# Altium schematic sheet MMC-MAG.SchDoc
size A3; SheetNumber: 1; SheetTotal: 1
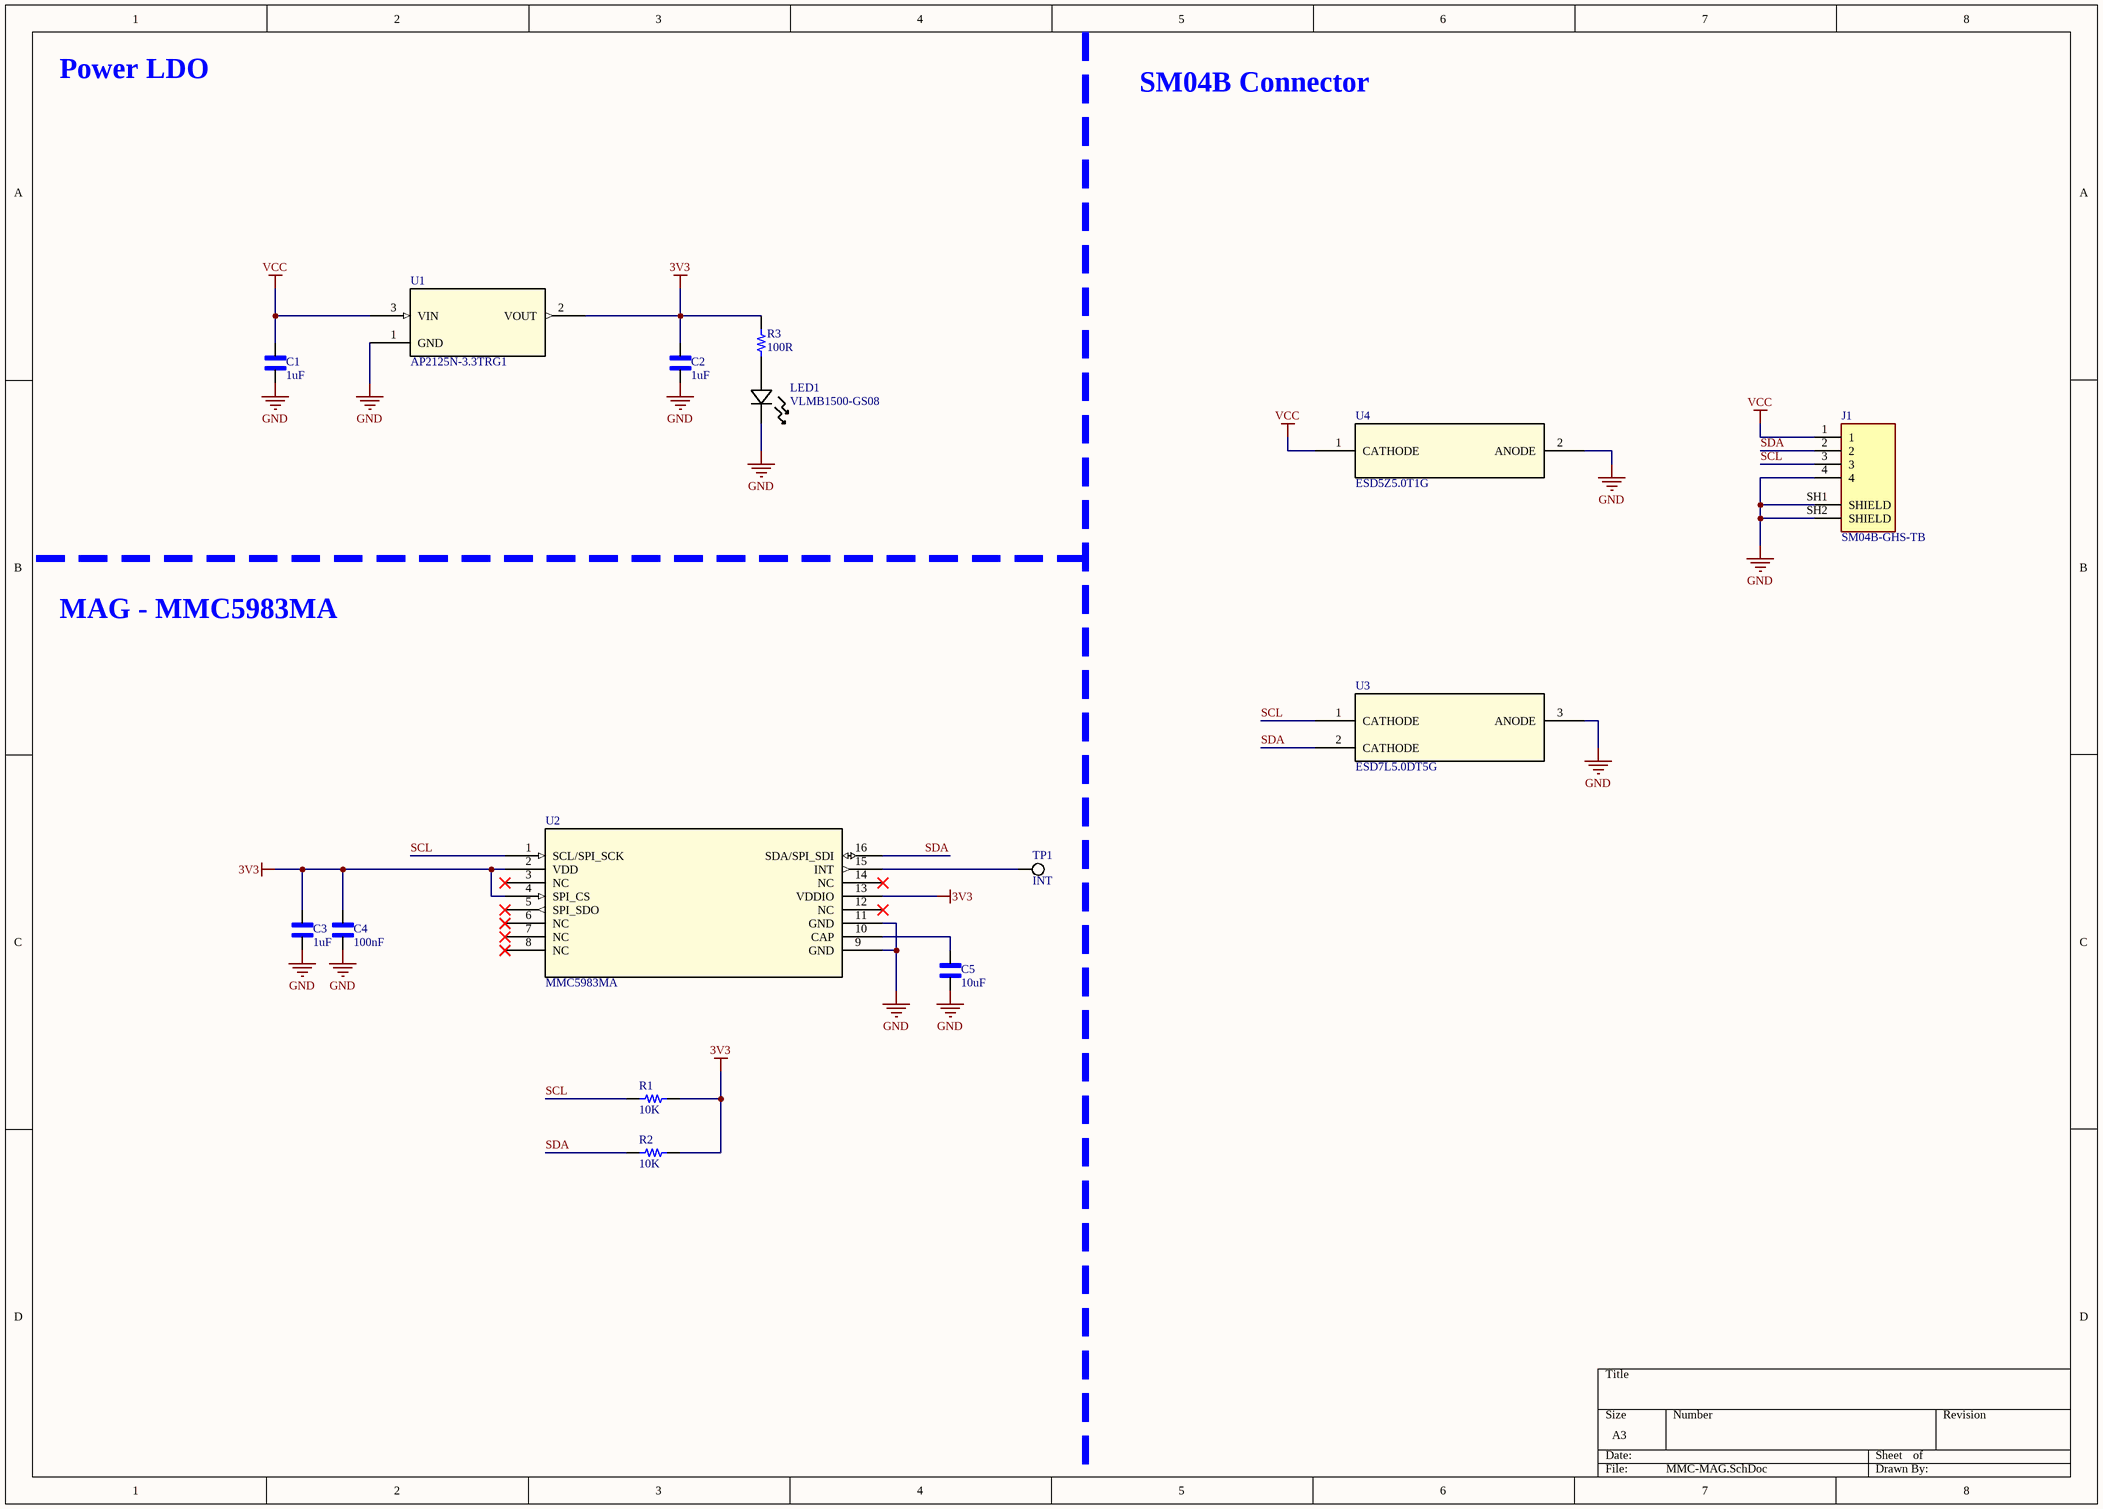
[diagram p0: MMC-MAG.SchDoc]

## Parts
C1  1uF  [CAP0402]
C2  1uF  [CAP0402]
C3  1uF  [CAP0402]
C4  100nF  [CAP0402]
C5  10uF  [CAP0402]
J1  SM04B-GHS-TB  [JST_SM04B-GHS-TB(LF)(SN)-]
LED1  VLMB1500-GS08  [LED_500-GS08_VIS]
R1  10K  [RES 0402_1005]
R2  10K  [RES 0402_1005]
R3  100R  [RES 0402_1005]
TP1  INT  [TEST_POINT]
U1  AP2125N-3.3TRG1  [SOT-23_DIO]
U2  MMC5983MA  [MMC5983MA_MEM]
U3  ESD7L5.0DT5G  [SOT-723_0P85X1P25_ONS]
U4  ESD5Z5.0T1G  [SOD-523_0P9X1P3_ONS]

## Nets
3V3: C2.2 C3.2 C4.2 R1.2 R2.1 R3.2 U1.2(VOUT) U2.2(VDD) U2.4(SPI_CS) U2.13(VDDIO)
GND: C1.1 C2.1 C3.1 C4.1 C5.1 J1.4 J1.SH1(SHIELD) J1.SH2(SHIELD) LED1.1 U1.1(GND) U2.9(GND) U2.11(GND) U3.3(ANODE) U4.2(ANODE)
VCC: C1.2 J1.1 U1.3(VIN) U4.1(CATHODE)
SCL: J1.3 R1.1 U2.1(SCL/SPI_SCK) U3.1(CATHODE)
SDA: J1.2 R2.2 U2.16(SDA/SPI_SDI) U3.2(CATHODE)
NetC5_2: C5.2 U2.10(CAP)
NetLED1_2: LED1.2 R3.1
NetTP1_1: TP1.1 U2.15(INT)

Not connected (* = marked no-connect by the designer): U2 3(NC)* 5(SPI_SDO)* 6(NC)* 7(NC)* 8(NC)* 12(NC)* 14(NC)*

## Notes on the sheet
- Power LDO
- SM04B Connector
- MAG - MMC5983MA

## Library data of the parts
C1-C3 = GRM155R61E105KA12D: 1 ÂµF Â±10% 25V Ceramic Capacitor X5R 0402 (1005 Metric); MF: Murata; SnapEDA_Link: https://www.snapeda.com/parts/GRM155R61E105KA12D/Murata/view-part/?ref=snap; Package: 1005-2 Murata; Value: *; MPN: GRM155R61E105KA12D; Check_prices: https://www.snapeda.com/parts/GRM155R61E105KA12D/Murata/view-part/?ref=eda
C4 = GRM155R61A104KA01D: Ceramic Capacitor, Ceramic, 10V, 10% +Tol, 10% -Tol, X5R, 15% TC, 0.1uF, Surface Mount, 0402; Manufacturer: Murata; Manufacturer Lifecycle Status: NRND; Supplier: DigiKey; Supplier Part Number: 490-1318-1-ND; Manufacturer Part Number: GRM155R61A104KA01D; RoHS: Compliant; Category: Ceramic Capacitors; Stock: 2544850; Pricing: 1=0.1, 10=0.026, 50=0.0174, 100=0.0148, 500=0.0104, 1000=0.00907, 2500=0.00768, 5000=0.00684 (USD); Value: 100nF; Case/Package: 0402; Case Code (Imperial): 0402; Case Code (Metric): 1005; Depth: 500µm; Dielectric: X5R; Dielectric Material: Ceramic; Height: 500µm; Lead Free: Lead Free; Length: 1mm; Lifecycle Status: NRND; Max Operating Temperature: 85°C; Min Operating Temperature: -55°C; Mounting Technology: Surface Mount; Pins: 2; Number of Terminals: 2; Packaging: Cut Tape; Radiation Hardening: No; REACH SVHC: Yes; Schedule B: 8532240020, 8532240020|8532240020, 8532240020|8532240020|8532240020, 8532240020|8532240020|8532240020|8532240020; Termination: SMD/SMT; Thickness: 500µm; Tolerance: 10%; Voltage: 10V; Voltage Rating: 10V; Voltage Rating (DC): 10V; Width: 500µm; ComponentLink1URL: https://datasheet.octopart.com:443/GRM155R61A104KA01D-Murata-datasheet-78375005.pdf?src-supplier=Upverter; ComponentLink1Description: https://datasheet.octopart.com:443/GRM155R61A104KA01D-Murata-datasheet-78375005.pdf?src-supplier=Upverter; ComponentLink2URL: https://datasheet.octopart.com:443/GRM155R61A104KA01D-Murata-datasheet-102.pdf?src-supplier=Upverter; ComponentLink2Description: https://datasheet.octopart.com:443/GRM155R61A104KA01D-Murata-datasheet-102.pdf?src-supplier=Upverter; ComponentLink3URL: https://datasheet.octopart.com:443/GRM155R61A104KA01D-Murata-datasheet-141446445.pdf?src-supplier=Upverter; ComponentLink3Description: https://datasheet.octopart.com:443/GRM155R61A104KA01D-Murata-datasheet-141446445.pdf?src-supplier=Upverter; ComponentLink4URL: https://datasheet.octopart.com:443/GRM155R61A104KA01D-Murata-datasheet-8817987.pdf?src-supplier=element14+APAC; ComponentLink4Description: https://datasheet.octopart.com:443/GRM155R61A104KA01D-Murata-datasheet-8817987.pdf?src-supplier=element14+APAC; ComponentLink5URL: https://datasheet.octopart.com:443/GRM155R61A104KA01D-Murata-datasheet-62317102.pdf?src-supplier=element14+APAC; ComponentLink5Description: https://datasheet.octopart.com:443/GRM155R61A104KA01D-Murata-datasheet-62317102.pdf?src-supplier=element14+APAC; ComponentLink6URL: https://datasheet.octopart.com:443/GRM155R61A104KA01D-Murata-datasheet-8329115.pdf?src-supplier=_legacy+Avnet; ComponentLink6Description: https://datasheet.octopart.com:443/GRM155R61A104KA01D-Murata-datasheet-8329115.pdf?src-supplier=_legacy+Avnet; ComponentLink7URL: https://datasheet.octopart.com:443/GRM155R61A104KA01D-Murata-datasheet-141266224.pdf?src-supplier=Ciiva; ComponentLink7Description: https://datasheet.octopart.com:443/GRM155R61A104KA01D-Murata-datasheet-141266224.pdf?src-supplier=Ciiva; ComponentLink8URL: https://datasheet.octopart.com:443/GRM155R61A104KA01D-Murata-datasheet-140689730.pdf?src-supplier=Ciiva; ComponentLink8Description: https://datasheet.octopart.com:443/GRM155R61A104KA01D-Murata-datasheet-140689730.pdf?src-supplier=Ciiva; ComponentLink9URL: https://datasheet.octopart.com:443/GRM155R61A104KA01D-Murata-datasheet-138740686.pdf?src-supplier=Ciiva; ComponentLink9Description: https://datasheet.octopart.com:443/GRM155R61A104KA01D-Murata-datasheet-138740686.pdf?src-supplier=Ciiva; ComponentLink10URL: https://datasheet.octopart.com:443/GRM155R61A104KA01D-Murata-datasheet-140710158.pdf?src-supplier=TME; ComponentLink10Description: https://datasheet.octopart.com:443/GRM155R61A104KA01D-Murata-datasheet-140710158.pdf?src-supplier=TME; ComponentLink11URL: https://datasheet.octopart.com:443/GRM155R61A104KA01D-Murata-datasheet-120101189.pdf?src-supplier=Megastar; ComponentLink11Description: https://datasheet.octopart.com:443/GRM155R61A104KA01D-Murata-datasheet-120101189.pdf?src-supplier=Megastar; ComponentLink12URL: https://datasheet.octopart.com:443/GRM155R61A104KA01D-Murata-datasheet-22122223.pdf?src-supplier=Future+Electronics; ComponentLink12Description: https://datasheet.octopart.com:443/GRM155R61A104KA01D-Murata-datasheet-22122223.pdf?src-supplier=Future+Electronics; ComponentLink13URL: https://datasheet.octopart.com:443/GRM155R61A104KA01D-Murata-datasheet-14396860.pdf?src-supplier=Future+Electronics; ComponentLink13Description: https://datasheet.octopart.com:443/GRM155R61A104KA01D-Murata-datasheet-14396860.pdf?src-supplier=Future+Electronics; ComponentLink14URL: https://datasheet.octopart.com:443/GRM155R61A104KA01D-Murata-datasheet-44106124.pdf?src-supplier=Future+Electronics; ComponentLink14Description: https://datasheet.octopart.com:443/GRM155R61A104KA01D-Murata-datasheet-44106124.pdf?src-supplier=Future+Electronics; ComponentLink15URL: https://datasheet.octopart.com/GRM155R61A104KA01D-Murata-datasheet-12515295.pdf; ComponentLink15Description: https://datasheet.octopart.com/GRM155R61A104KA01D-Murata-datasheet-12515295.pdf; ComponentLink16URL: https://datasheet.octopart.com/GRM155R61A104KA01D-Murata-datasheet-12510076.pdf; ComponentLink16Description: https://datasheet.octopart.com/GRM155R61A104KA01D-Murata-datasheet-12510076.pdf; ComponentLink17URL: https://datasheet.octopart.com/GRM155R61A104KA01D-Murata-datasheet-11978611.pdf; ComponentLink17Description: https://datasheet.octopart.com/GRM155R61A104KA01D-Murata-datasheet-11978611.pdf; ComponentLink18URL: https://datasheet.octopart.com/GRM155R61A104KA01D-Murata-datasheet-10025737.pdf; ComponentLink18Description: https://datasheet.octopart.com/GRM155R61A104KA01D-Murata-datasheet-10025737.pdf; ComponentLink19URL: https://datasheet.octopart.com/GRM155R61A104KA01D-Murata-datasheet-8819587.pdf; ComponentLink19Description: https://datasheet.octopart.com/GRM155R61A104KA01D-Murata-datasheet-8819587.pdf; ComponentLink20URL: https://datasheet.octopart.com/GRM155R61A104KA01D-Murata-datasheet-14400509.pdf; ComponentLink20Description: https://datasheet.octopart.com/GRM155R61A104KA01D-Murata-datasheet-14400509.pdf; ComponentLink21URL: https://datasheet.octopart.com:443/GRM155R61A104KA01D-Murata-datasheet-12510170.pdf?src-supplier=Factory+Futures; ComponentLink21Description: https://datasheet.octopart.com:443/GRM155R61A104KA01D-Murata-datasheet-12510170.pdf?src-supplier=Factory+Futures; ComponentLink22URL: https://datasheet.octopart.com:443/GRM155R61A104KA01D-Murata-datasheet-8517407.pdf?src-supplier=Factory+Futures; ComponentLink22Description: https://datasheet.octopart.com:443/GRM155R61A104KA01D-Murata-datasheet-8517407.pdf?src-supplier=Factory+Futures; ComponentLink23URL: https://datasheet.octopart.com:443/GRM155R61A104KA01D-Murata-datasheet-8387045.pdf?src-supplier=Factory+Futures; ComponentLink23Description: https://datasheet.octopart.com:443/GRM155R61A104KA01D-Murata-datasheet-8387045.pdf?src-supplier=Factory+Futures; ComponentLink24URL: https://datasheet.octopart.com:443/GRM155R61A104KA01D-Murata-datasheet-8324201.pdf?src-supplier=Factory+Futures; ComponentLink24Description: https://datasheet.octopart.com:443/GRM155R61A104KA01D-Murata-datasheet-8324201.pdf?src-supplier=Factory+Futures; ComponentLink25URL: https://datasheet.octopart.com:443/GRM155R61A104KA01D-Murata-datasheet-7628724.pdf?src-supplier=Factory+Futures; ComponentLink25Description: https://datasheet.octopart.com:443/GRM155R61A104KA01D-Murata-datasheet-7628724.pdf?src-supplier=Factory+Futures; ComponentLink26URL: https://datasheet.octopart.com:443/GRM155R61A104KA01D-Murata-datasheet-552801.pdf?src-supplier=Factory+Futures; ComponentLink26Description: https://datasheet.octopart.com:443/GRM155R61A104KA01D-Murata-datasheet-552801.pdf?src-supplier=Factory+Futures; ComponentLink27URL: https://datasheet.octopart.com:443/GRM155R61A104KA01D-Murata-datasheet-11797706.pdf?src-supplier=Arrow+Electronics; ComponentLink27Description: https://datasheet.octopart.com:443/GRM155R61A104KA01D-Murata-datasheet-11797706.pdf?src-supplier=Arrow+Electronics; ComponentLink28URL: https://datasheet.octopart.com:443/GRM155R61A104KA01D.-Murata-datasheet-5332913.pdf?src-supplier=Farnell; ComponentLink28Description: https://datasheet.octopart.com:443/GRM155R61A104KA01D.-Murata-datasheet-5332913.pdf?src-supplier=Farnell; ComponentLink29URL: http://sigma.octopart.com:80/reach_statement/Murata-company-16.pdf?src-supplier=Compliance+Statements; ComponentLink29Description: http://sigma.octopart.com:80/reach_statement/Murata-company-16.pdf?src-supplier=Compliance+Statements
C5 = GRM155R61A106ME11D: Ceramic Capacitor, Ceramic, 10V, 20% +Tol, 20% -Tol, X5R, 15% TC, 10uF, Surface Mount, 0402; Manufacturer: Murata; Manufacturer Lifecycle Status: IN PRODUCTION; Value: 10µF; Supplier: DigiKey; Supplier Part Number: 490-GRM155R61A106ME11DCT-ND; Manufacturer Part Number: GRM155R61A106ME11D; RoHS: Compliant; Category: Ceramic Capacitors; Stock: 1513396; Pricing: 1=0.08, 10=0.014 (USD); Case/Package: 0402; Dielectric: X5R; Dielectric Material: Ceramic; Height: 500µm; Length: 1mm; Lifecycle Status: Production; Material: Ceramic; Max Operating Temperature: 85°C; Min Operating Temperature: -55°C; Mounting Technology: Surface Mount; Number of Terminals: 2; REACH SVHC: Yes; Thickness: 500µm; Tolerance: 20%; Voltage Rating: 10V; Voltage Rating (DC): 10V; Width: 500µm; ComponentLink1URL: https://datasheet.octopart.com:443/GRM155R61A106ME11D-Murata-datasheet-155239053.pdf?src-supplier=Newark; ComponentLink1Description: https://datasheet.octopart.com:443/GRM155R61A106ME11D-Murata-datasheet-155239053.pdf?src-supplier=Newark; ComponentLink2URL: https://datasheet.octopart.com:443/GRM155R61A106ME11D-Murata-datasheet-178522865.pdf?src-supplier=Arrow.cn; ComponentLink2Description: https://datasheet.octopart.com:443/GRM155R61A106ME11D-Murata-datasheet-178522865.pdf?src-supplier=Arrow.cn; ComponentLink3URL: https://datasheet.octopart.com:443/GRM155R61A106ME11D-Murata-datasheet-165579666.pdf?src-supplier=TME; ComponentLink3Description: https://datasheet.octopart.com:443/GRM155R61A106ME11D-Murata-datasheet-165579666.pdf?src-supplier=TME; ComponentLink4URL: https://datasheet.octopart.com:443/GRM155R61A106ME11D-Murata-datasheet-141266224.pdf?src-supplier=Ciiva; ComponentLink4Description: https://datasheet.octopart.com:443/GRM155R61A106ME11D-Murata-datasheet-141266224.pdf?src-supplier=Ciiva; ComponentLink5URL: https://datasheet.octopart.com:443/GRM155R61A106ME11D-Murata-datasheet-140689744.pdf?src-supplier=Ciiva; ComponentLink5Description: https://datasheet.octopart.com:443/GRM155R61A106ME11D-Murata-datasheet-140689744.pdf?src-supplier=Ciiva; ComponentLink6URL: https://datasheet.octopart.com:443/GRM155R61A106ME11D-Murata-datasheet-138740692.pdf?src-supplier=Ciiva; ComponentLink6Description: https://datasheet.octopart.com:443/GRM155R61A106ME11D-Murata-datasheet-138740692.pdf?src-supplier=Ciiva; ComponentLink7URL: https://datasheet.octopart.com/GRM155R61A106ME11D-Murata-datasheet-12515295.pdf; ComponentLink7Description: https://datasheet.octopart.com/GRM155R61A106ME11D-Murata-datasheet-12515295.pdf; ComponentLink8URL: https://datasheet.octopart.com/GRM155R61A106ME11D-Murata-datasheet-12510076.pdf; ComponentLink8Description: https://datasheet.octopart.com/GRM155R61A106ME11D-Murata-datasheet-12510076.pdf; ComponentLink9URL: https://datasheet.octopart.com/GRM155R61A106ME11D-Murata-datasheet-11978611.pdf; ComponentLink9Description: https://datasheet.octopart.com/GRM155R61A106ME11D-Murata-datasheet-11978611.pdf; ComponentLink10URL: https://datasheet.octopart.com/GRM155R61A106ME11D-Murata-datasheet-10025737.pdf; ComponentLink10Description: https://datasheet.octopart.com/GRM155R61A106ME11D-Murata-datasheet-10025737.pdf; ComponentLink11URL: https://datasheet.octopart.com/GRM155R61A106ME11D-Murata-datasheet-8819587.pdf; ComponentLink11Description: https://datasheet.octopart.com/GRM155R61A106ME11D-Murata-datasheet-8819587.pdf; ComponentLink12URL: http://sigma.octopart.com:80/reach_statement/Murata-company-16.pdf?src-supplier=Compliance+Statements; ComponentLink12Description: http://sigma.octopart.com:80/reach_statement/Murata-company-16.pdf?src-supplier=Compliance+Statements
J1 = SM04B-GHS-TB(LF)(SN)-: Connector Header Surface Mount, Right Angle 4 position 0.049 (1.25mm); MF: JST Sales America Inc.; SnapEDA_Link: https://www.snapeda.com/parts/SM04B-GHS-TB(LF)(SN)/JST/view-part/?ref=snap; Package: None; Value: *; MPN: SM04B-GHS-TB(LF)(SN); Check_prices: https://www.snapeda.com/parts/SM04B-GHS-TB(LF)(SN)/JST/view-part/?ref=eda
LED1 = VLMB1500-GS08: CHIPLED(0402) BLUE ULTRABRIGHT -e4; Manufacturer_Name: Vishay; Copyright: Copyright (C) 2025 Ultra Librarian. All rights reserved.; MPN: VLMB1500-GS08
R1 R2 = RC0402JR-0710KL: Res Thick Film 0402 10K Ohm 5% 0.063W(1/16W) ±100ppm/C Pad SMD T/R; Manufacturer: Yageo Group; Max Power Dissipation: 63mW; Power Dissipation: 62.5mW; Value: 10kΩ; Temperature Coefficient: 100ppm/°C; Voltage Rating: 50V; Supplier: DigiKey; Supplier Part Number: 311-10KJRTR-ND; Manufacturer Part Number: RC0402JR-0710KL; RoHS: Compliant; Category: Chip SMD Resistors; Stock: 11091527; Pricing: 10000=0.00204, 20000=0.0017, 30000=0.00166, 50000=0.00153, 70000=0.00152 (USD); Case/Package: 0402; Case Code (Imperial): 0402; China RoHS: Non-Compliant; Composition: Thick Film; Depth: 500µm; Features: Moisture Resistant; Height: 350µm; Lead Free: Lead Free; Length: 1mm; Lifecycle Status: Production; Max Operating Temperature: 155°C; Military Standard: Not; Min Operating Temperature: -55°C; Mounting Technology: Surface Mount; Pins: 2; Number of Terminals: 2; Number of Terminations: 2; Packaging: Tape & Reel; Power Rating: 62.5mW; REACH SVHC: Yes; Schedule B: 8533210045, 8533210045|8533210045, 8533210045|8533210045|8533210045, 8533210045|8533210045|8533210045|8533210045; Termination: SMD/SMT; Tolerance: 5%; Voltage Rating (AC): 50V; Voltage Rating (DC): 50V; Width: 500µm; Working Voltage: 50V; ComponentLink1URL: https://datasheet.octopart.com:443/RC0402JR-0710KL-Yageo-datasheet-175887523.pdf?src-supplier=IHS; ComponentLink1Description: https://datasheet.octopart.com:443/RC0402JR-0710KL-Yageo-datasheet-175887523.pdf?src-supplier=IHS; ComponentLink2URL: https://datasheet.octopart.com:443/RC0402JR-0710KL-Yageo-datasheet-10408619.pdf?src-supplier=Newark; ComponentLink2Description: https://datasheet.octopart.com:443/RC0402JR-0710KL-Yageo-datasheet-10408619.pdf?src-supplier=Newark; ComponentLink3URL: https://datasheet.octopart.com:443/RC0402JR-0710KL-Yageo-datasheet-505231.pdf?src-supplier=Newark; ComponentLink3Description: https://datasheet.octopart.com:443/RC0402JR-0710KL-Yageo-datasheet-505231.pdf?src-supplier=Newark; ComponentLink4URL: https://datasheet.octopart.com:443/RC0402JR-0710KL-Yageo-Group-datasheet-176638170.pdf?src-supplier=Newark; ComponentLink4Description: https://datasheet.octopart.com:443/RC0402JR-0710KL-Yageo-Group-datasheet-176638170.pdf?src-supplier=Newark; ComponentLink5URL: https://datasheet.octopart.com:443/RC0402JR-0710KL-Yageo-datasheet-141265859.pdf?src-supplier=Upverter; ComponentLink5Description: https://datasheet.octopart.com:443/RC0402JR-0710KL-Yageo-datasheet-141265859.pdf?src-supplier=Upverter; ComponentLink6URL: https://sigma.octopart.com:443/138820526/technical_drawing/Yageo-RC0402JR-0710KL.pdf?src-supplier=Upverter; ComponentLink6Description: https://sigma.octopart.com:443/138820526/technical_drawing/Yageo-RC0402JR-0710KL.pdf?src-supplier=Upverter; ComponentLink7URL: https://datasheet.octopart.com:443/RC0402JR-0710KL-Yageo-datasheet-62067350.pdf?src-supplier=Farnell; ComponentLink7Description: https://datasheet.octopart.com:443/RC0402JR-0710KL-Yageo-datasheet-62067350.pdf?src-supplier=Farnell; ComponentLink8URL: https://datasheet.octopart.com:443/RC0402JR-0710KL-Yageo-datasheet-12531192.pdf?src-supplier=Seeed+Studio; ComponentLink8Description: https://datasheet.octopart.com:443/RC0402JR-0710KL-Yageo-datasheet-12531192.pdf?src-supplier=Seeed+Studio; ComponentLink9URL: https://datasheet.octopart.com:443/RC0402JR-0710KL-Yageo-datasheet-8324527.pdf?src-supplier=TME; ComponentLink9Description: https://datasheet.octopart.com:443/RC0402JR-0710KL-Yageo-datasheet-8324527.pdf?src-supplier=TME; ComponentLink10URL: https://datasheet.octopart.com:443/RC0402JR-0710KL-Yageo-datasheet-164759695.pdf?src-supplier=Future+Electronics; ComponentLink10Description: https://datasheet.octopart.com:443/RC0402JR-0710KL-Yageo-datasheet-164759695.pdf?src-supplier=Future+Electronics; ComponentLink11URL: https://datasheet.octopart.com:443/RC0402JR-0710KL-Yageo-datasheet-137700087.pdf?src-supplier=Future+Electronics; ComponentLink11Description: https://datasheet.octopart.com:443/RC0402JR-0710KL-Yageo-datasheet-137700087.pdf?src-supplier=Future+Electronics; ComponentLink12URL: https://datasheet.octopart.com/RC0402JR-0710KL-Yageo-datasheet-73766026.pdf; ComponentLink12Description: https://datasheet.octopart.com/RC0402JR-0710KL-Yageo-datasheet-73766026.pdf; ComponentLink13URL: https://datasheet.octopart.com:443/RC0402JR-0710KL-Yageo-datasheet-8329306.pdf?src-supplier=element14; ComponentLink13Description: https://datasheet.octopart.com:443/RC0402JR-0710KL-Yageo-datasheet-8329306.pdf?src-supplier=element14; ComponentLink14URL: http://sigma.octopart.com:80/rohs_statement/Yageo-company-2.pdf?src-supplier=Compliance+Statements; ComponentLink14Description: http://sigma.octopart.com:80/rohs_statement/Yageo-company-2.pdf?src-supplier=Compliance+Statements; ComponentLink15URL: http://sigma.octopart.com:80/conflict_mineral_statement/Yageo-company-3.pdf?src-supplier=Compliance+Statements; ComponentLink15Description: http://sigma.octopart.com:80/conflict_mineral_statement/Yageo-company-3.pdf?src-supplier=Compliance+Statements
R3 = CRCW0402100RFKEDHP: Res Thick Film 0402 100 Ohm 1% 0.2W ±100ppm/°C Molded SMD SMD Paper T/R; Manufacturer: Vishay; Manufacturer Package Identifier: CRCW0402-HPe3; Power Dissipation: 200mW; Value: 100Ω; Voltage Rating: 50V; Supplier: DigiKey; Supplier Part Number: 541-100YCT-ND; Manufacturer Part Number: CRCW0402100RFKEDHP; RoHS: Compliant; Category: Chip SMD Resistors; Stock: 503629; Pricing: 1=0.11, 10=0.054, 25=0.0412, 50=0.034, 100=0.0286, 250=0.02312, 500=0.02002, 1000=0.01755, 5000=0.01363 (USD); Case/Package: 0402; Case Code (Imperial): 0402; Case Code (Metric): 1005; China RoHS: Non-Compliant; Composition: Thick Film; Contact Plating: Tin; Depth: 500µm; Height: 300µm; Lead Free: Lead Free; Length: 1mm; Lifecycle Status: Production; Max Operating Temperature: 155°C; Min Operating Temperature: -55°C; Mounting Technology: Surface Mount; Number of Terminals: 2; Packaging: Cut Tape; Power Rating: 200mW; Radiation Hardening: No; REACH SVHC: Yes; Schedule B: 8533210045, 8533210045|8533210045|8533210045|8533210045|8533210045|8533210045|8533210045, 8533210045|8533210045|8533210045|8533210045|8533210045|8533210045|8533210045|8533210045, 8533210045|8533210045|8533210045|8533210045|8533210045|8533210045|8533210045|8533210045|8533210045; Temperature Coefficient: 100ppm/°C; Termination: SMD/SMT; Tolerance: 1%; Voltage Rating (DC): 50V; Weight: 652.039032µg; Width: 500µm; Working Voltage: 50V; ComponentLink1URL: https://datasheet.octopart.com/CRCW0402100RFKEDHP-Vishay-datasheet-83567917.pdf; ComponentLink1Description: https://datasheet.octopart.com/CRCW0402100RFKEDHP-Vishay-datasheet-83567917.pdf; ComponentLink2URL: https://datasheet.octopart.com/D-CRCW-e3-Standard-Thick-Film-Chip-Resistors-Vishay-datasheet-family-64.pdf; ComponentLink2Description: https://datasheet.octopart.com/D-CRCW-e3-Standard-Thick-Film-Chip-Resistors-Vishay-datasheet-family-64.pdf; ComponentLink3URL: https://datasheet.octopart.com:443/CRCW0402100RFKEDHP-Vishay-datasheet-87136057.pdf?src-supplier=element14+APAC; ComponentLink3Description: https://datasheet.octopart.com:443/CRCW0402100RFKEDHP-Vishay-datasheet-87136057.pdf?src-supplier=element14+APAC; ComponentLink4URL: https://datasheet.octopart.com:443/CRCW0402100RFKEDHP-Vishay-datasheet-78776210.pdf?src-supplier=element14+APAC; ComponentLink4Description: https://datasheet.octopart.com:443/CRCW0402100RFKEDHP-Vishay-datasheet-78776210.pdf?src-supplier=element14+APAC; ComponentLink5URL: https://datasheet.octopart.com:443/CRCW0402100RFKEDHP-Vishay-datasheet-62317933.pdf?src-supplier=element14+APAC; ComponentLink5Description: https://datasheet.octopart.com:443/CRCW0402100RFKEDHP-Vishay-datasheet-62317933.pdf?src-supplier=element14+APAC; ComponentLink6URL: https://datasheet.octopart.com:443/CRCW0402100RFKEDHP-Vishay-datasheet-37143532.pdf?src-supplier=element14+APAC; ComponentLink6Description: https://datasheet.octopart.com:443/CRCW0402100RFKEDHP-Vishay-datasheet-37143532.pdf?src-supplier=element14+APAC; ComponentLink7URL: https://datasheet.octopart.com:443/CRCW0402100RFKEDHP-Vishay-datasheet-66581887.pdf?src-supplier=element14+APAC; ComponentLink7Description: https://datasheet.octopart.com:443/CRCW0402100RFKEDHP-Vishay-datasheet-66581887.pdf?src-supplier=element14+APAC; ComponentLink8URL: https://datasheet.octopart.com:443/CRCW0402100RFKEDHP-Vishay-datasheet-13148866.pdf?src-supplier=_legacy+Avnet; ComponentLink8Description: https://datasheet.octopart.com:443/CRCW0402100RFKEDHP-Vishay-datasheet-13148866.pdf?src-supplier=_legacy+Avnet; ComponentLink9URL: https://datasheet.octopart.com:443/CRCW0402100RFKEDHP-Vishay-datasheet-13131392.pdf?src-supplier=_legacy+Avnet; ComponentLink9Description: https://datasheet.octopart.com:443/CRCW0402100RFKEDHP-Vishay-datasheet-13131392.pdf?src-supplier=_legacy+Avnet; ComponentLink10URL: https://datasheet.octopart.com:443/CRCW0402100RFKEDHP-Vishay-datasheet-12593106.pdf?src-supplier=_legacy+Avnet; ComponentLink10Description: https://datasheet.octopart.com:443/CRCW0402100RFKEDHP-Vishay-datasheet-12593106.pdf?src-supplier=_legacy+Avnet; ComponentLink11URL: https://datasheet.octopart.com:443/CRCW0402100RFKEDHP-Vishay-datasheet-12544674.pdf?src-supplier=_legacy+Avnet; ComponentLink11Description: https://datasheet.octopart.com:443/CRCW0402100RFKEDHP-Vishay-datasheet-12544674.pdf?src-supplier=_legacy+Avnet; ComponentLink12URL: https://datasheet.octopart.com:443/CRCW0402100RFKEDHP-Vishay-datasheet-12531795.pdf?src-supplier=_legacy+Avnet; ComponentLink12Description: https://datasheet.octopart.com:443/CRCW0402100RFKEDHP-Vishay-datasheet-12531795.pdf?src-supplier=_legacy+Avnet; ComponentLink13URL: https://datasheet.octopart.com:443/CRCW0402100RFKEDHP-Vishay-datasheet-12518686.pdf?src-supplier=_legacy+Avnet; ComponentLink13Description: https://datasheet.octopart.com:443/CRCW0402100RFKEDHP-Vishay-datasheet-12518686.pdf?src-supplier=_legacy+Avnet; ComponentLink14URL: https://datasheet.octopart.com:443/CRCW0402100RFKEDHP-Vishay-datasheet-12509906.pdf?src-supplier=_legacy+Avnet; ComponentLink14Description: https://datasheet.octopart.com:443/CRCW0402100RFKEDHP-Vishay-datasheet-12509906.pdf?src-supplier=_legacy+Avnet; ComponentLink15URL: https://datasheet.octopart.com:443/CRCW0402100RFKEDHP-Vishay-datasheet-10669844.pdf?src-supplier=_legacy+Avnet; ComponentLink15Description: https://datasheet.octopart.com:443/CRCW0402100RFKEDHP-Vishay-datasheet-10669844.pdf?src-supplier=_legacy+Avnet; ComponentLink16URL: https://datasheet.octopart.com:443/CRCW0402100RFKEDHP-Vishay-datasheet-8703221.pdf?src-supplier=_legacy+Avnet; ComponentLink16Description: https://datasheet.octopart.com:443/CRCW0402100RFKEDHP-Vishay-datasheet-8703221.pdf?src-supplier=_legacy+Avnet; ComponentLink17URL: https://datasheet.octopart.com:443/CRCW0402100RFKEDHP-Vishay-datasheet-62316122.pdf?src-supplier=Future+Electronics; ComponentLink17Description: https://datasheet.octopart.com:443/CRCW0402100RFKEDHP-Vishay-datasheet-62316122.pdf?src-supplier=Future+Electronics; ComponentLink18URL: https://datasheet.octopart.com:443/CRCW0402100RFKEDHP-Vishay-Dale-datasheet-47688881.pdf?src-supplier=RS+(Formerly+Allied+Electronics); ComponentLink18Description: https://datasheet.octopart.com:443/CRCW0402100RFKEDHP-Vishay-Dale-datasheet-47688881.pdf?src-supplier=RS+(Formerly+Allied+Electronics); ComponentLink19URL: https://datasheet.octopart.com:443/CRCW0402100RFKEDHP-Vishay-datasheet-8359436.pdf?src-supplier=Newark; ComponentLink19Description: https://datasheet.octopart.com:443/CRCW0402100RFKEDHP-Vishay-datasheet-8359436.pdf?src-supplier=Newark; ComponentLink20URL: http://sigma.octopart.com:80/rohs_certificate/D-CRCW-e3-Standard-Thick-Film-Chip-Resistors-Vishay-family-102.pdf?src-supplier=Compliance+Statements; ComponentLink20Description: http://sigma.octopart.com:80/rohs_certificate/D-CRCW-e3-Standard-Thick-Film-Chip-Resistors-Vishay-family-102.pdf?src-supplier=Compliance+Statements
TP1 = TEST_POINT
U1 = AP2125N-3.3TRG1: IC REG LINEAR 3.3V 300MA SOT23-3; Manufacturer_Name: Diodes Inc; Type: Power Management; Copyright: Copyright (C) 2025 Ultra Librarian. All rights reserved.; Manufacturer_Part_Number: AP2125N-3.3TRG1; RefDes: RefDes
U2 = MMC5983MA: 3-AXIS MAGNETIC SENSOR; Manufacturer_Name: Memsic; Copyright: Copyright (C) 2025 Ultra Librarian. All rights reserved.; Manufacturer_Part_Number: MMC5983MA; RefDes: RefDes; Type: Type
U3 = ESD7L5.0DT5G: TVS DIODE 5VWM 10.4VC SOT723; Manufacturer_Name: onsemi; Copyright: Copyright (C) 2025 Ultra Librarian. All rights reserved.; Manufacturer_Part_Number: ESD7L5.0DT5G; RefDes: RefDes; Type: Type
U4 = ESD5Z5.0T1G: TVS DIODE 5VWM 18.6VC SOD523; Manufacturer_Name: onsemi; Copyright: Copyright (C) 2025 Ultra Librarian. All rights reserved.; Manufacturer_Part_Number: ESD5Z5.0T1G; RefDes: RefDes; Type: Type